# Altium schematic sheet hdmi.SchDoc
size A
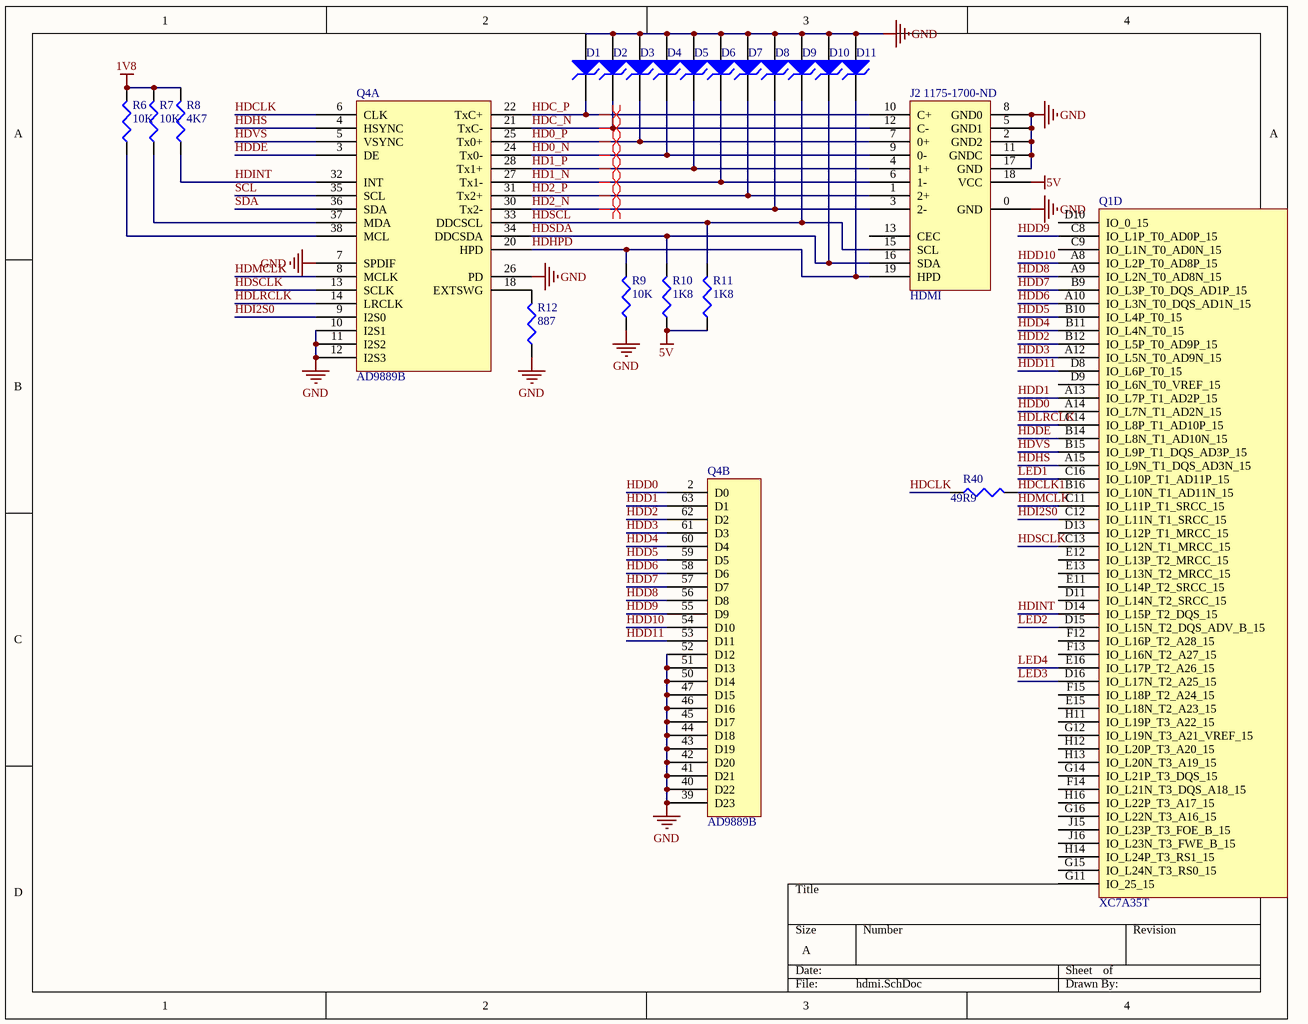
[diagram p0: hdmi.SchDoc]

## Parts
D1  EZAEG2A  [CAPC1005X55N]  (value not drawn)
D2  EZAEG2A  [CAPC1005X55N]  (value not drawn)
D3  EZAEG2A  [CAPC1005X55N]  (value not drawn)
D4  EZAEG2A  [CAPC1005X55N]  (value not drawn)
D5  EZAEG2A  [CAPC1005X55N]  (value not drawn)
D6  EZAEG2A  [CAPC1005X55N]  (value not drawn)
D7  EZAEG2A  [CAPC1005X55N]  (value not drawn)
D8  EZAEG2A  [CAPC1005X55N]  (value not drawn)
D9  EZAEG2A  [CAPC1005X55N]  (value not drawn)
D10  EZAEG2A  [CAPC1005X55N]  (value not drawn)
D11  EZAEG2A  [CAPC1005X55N]  (value not drawn)
J2  HDMI  Supplier Part Number 1: 1175-1700-ND  [2000-1-1-20-00-BK]
Q1  XC7A35T  (part D of 6)
Q4  AD9889B  [QFN50P900X875X100_HS-65N]  (parts A,B of 3)
R6  value 10K  [CAPC1608X90N]  (hidden comment: Res3)
R7  value 10K  [CAPC1608X90N]  (hidden comment: Res3)
R8  value 4K7  [CAPC1608X90N]  (hidden comment: Res3)
R9  value 10K  [CAPC1608X90N]  (hidden comment: Res3)
R10  value 1K8  [CAPC1608X90N]  (hidden comment: Res3)
R11  value 1K8  [CAPC1608X90N]  (hidden comment: Res3)
R12  value 887  [CAPC1608X90N]  (hidden comment: Res3)
R40  value 49R9  [CAPC1005X06L]  (hidden comment: Res3)

## Nets
1V8: R6.2 R7.2 R8.2
5V: J2.18(VCC) R10.1 R11.1
GND: D1.1(A) D2.1(A) D3.1(A) D4.1(A) D5.1(A) D6.1(A) D7.1(A) D8.1(A) D9.1(A) D10.1(A) D11.1(A) J2.0(GND) J2.2(GND2) J2.5(GND1) J2.8(GND0) J2.11(GNDC) J2.17(GND) Q4.7(SPDIF) Q4.10(I2S1) Q4.11(I2S2) Q4.12(I2S3) Q4.26(PD) Q4.39(D23) Q4.40(D22) Q4.41(D21) Q4.42(D20) Q4.43(D19) Q4.44(D18) Q4.45(D17) Q4.46(D16) Q4.47(D15) Q4.50(D14) Q4.51(D13) Q4.52(D12) R9.1 R12.1
HD0_N: D4.2(K) J2.9(0-) Q4.24(Tx0-)
HD0_P: D3.2(K) J2.7(0+) Q4.25(Tx0+)
HD1_N: D6.2(K) J2.6(1-) Q4.27(Tx1-)
HD1_P: D5.2(K) J2.4(1+) Q4.28(Tx1+)
HD2_N: D8.2(K) J2.3(2-) Q4.30(Tx2-)
HD2_P: D7.2(K) J2.1(2+) Q4.31(Tx2+)
HDC_N: D2.2(K) J2.12(C-) Q4.21(TxC-)
HDC_P: D1.2(K) J2.10(C+) Q4.22(TxC+)
HDCLK: Q4.6(CLK) R40.1
HDCLK1: Q1.B16(IO_L10N_T1_AD11N_15) R40.2
HDD0: Q1.A14(IO_L7N_T1_AD2N_15) Q4.2(D0)
HDD1: Q1.A13(IO_L7P_T1_AD2P_15) Q4.63(D1)
HDD2: Q1.B12(IO_L5P_T0_AD9P_15) Q4.62(D2)
HDD3: Q1.A12(IO_L5N_T0_AD9N_15) Q4.61(D3)
HDD4: Q1.B11(IO_L4N_T0_15) Q4.60(D4)
HDD5: Q1.B10(IO_L4P_T0_15) Q4.59(D5)
HDD6: Q1.A10(IO_L3N_T0_DQS_AD1N_15) Q4.58(D6)
HDD7: Q1.B9(IO_L3P_T0_DQS_AD1P_15) Q4.57(D7)
HDD8: Q1.A9(IO_L2N_T0_AD8N_15) Q4.56(D8)
HDD9: Q1.C8(IO_L1P_T0_AD0P_15) Q4.55(D9)
HDD10: Q1.A8(IO_L2P_T0_AD8P_15) Q4.54(D10)
HDD11: Q1.D8(IO_L6P_T0_15) Q4.53(D11)
HDDE: Q1.B14(IO_L8N_T1_AD10N_15) Q4.3(DE)
HDHPD: D11.2(K) J2.19(HPD) Q4.20(HPD) R9.2
HDHS: Q1.A15(IO_L9N_T1_DQS_AD3N_15) Q4.4(HSYNC)
HDI2S0: Q1.C12(IO_L11N_T1_SRCC_15) Q4.9(I2S0)
HDINT: Q1.D14(IO_L15P_T2_DQS_15) Q4.32(INT) R8.1
HDLRCLK: Q1.C14(IO_L8P_T1_AD10P_15) Q4.14(LRCLK)
HDMCLK: Q1.C11(IO_L11P_T1_SRCC_15) Q4.8(MCLK)
HDSCL: D9.2(K) J2.15(SCL) Q4.33(DDCSCL) R11.2
HDSCLK: Q1.C13(IO_L12N_T1_MRCC_15) Q4.13(SCLK)
HDSDA: D10.2(K) J2.16(SDA) Q4.34(DDCSDA) R10.2
HDVS: Q1.B15(IO_L9P_T1_DQS_AD3P_15) Q4.5(VSYNC)
LED1: Q1.C16(IO_L10P_T1_AD11P_15)
LED2: Q1.D15(IO_L15N_T2_DQS_ADV_B_15)
LED3: Q1.D16(IO_L17N_T2_A25_15)
LED4: Q1.E16(IO_L17P_T2_A26_15)
SCL: Q4.35(SCL)
SDA: Q4.36(SDA)
NetQ4_18: Q4.18(EXTSWG) R12.2
NetQ4_37: Q4.37(MDA) R7.1
NetQ4_38: Q4.38(MCL) R6.1

Not connected (* = marked no-connect by the designer): J2 13(CEC); Q1 C9(IO_L1N_T0_AD0N_15) D9(IO_L6N_T0_VREF_15) D10(IO_0_15) D11(IO_L14N_T2_SRCC_15) D13(IO_L12P_T1_MRCC_15) E11(IO_L14P_T2_SRCC_15) E12(IO_L13P_T2_MRCC_15) E13(IO_L13N_T2_MRCC_15) E15(IO_L18N_T2_A23_15) F12(IO_L16P_T2_A28_15) F13(IO_L16N_T2_A27_15) F14(IO_L21N_T3_DQS_A18_15) F15(IO_L18P_T2_A24_15) G11(IO_25_15) G12(IO_L19N_T3_A21_VREF_15) G14(IO_L21P_T3_DQS_15) G15(IO_L24N_T3_RS0_15) G16(IO_L22N_T3_A16_15) H11(IO_L19P_T3_A22_15) H12(IO_L20P_T3_A20_15) H13(IO_L20N_T3_A19_15) H14(IO_L24P_T3_RS1_15) H16(IO_L22P_T3_A17_15) J15(IO_L23P_T3_FOE_B_15) J16(IO_L23N_T3_FWE_B_15)

## Layout directives
differential pair: HD0_N, HD0_P, HD1_N, HD1_P, HD2_N, HD2_P, HDC_N, HDC_P

## Library data of the parts
D1-D11 = D Zener: Zener Diode; Published: 8-Jun-2000; LatestRevisionDate: 17-Jul-2002; LatestRevisionNote: Re-released for DXP Platform.; PackageReference: DIODE-0.7; Publisher: Altium Limited; PackageDescription: Diode, Thru-Hole; 2 Leads; 0.7 in Pin Spacing; Supplier 1: Digi-Key; Supplier Part Number 1: P13571CT-ND
R6-R12 R40 = Res3: Resistor; Published: 8-Jun-2000; LatestRevisionDate: 29-May-2009; LatestRevisionNote: IPC-7351 Footprint Added.; PackageReference: J1-0603; Publisher: Altium Limited; PackageDescription: Chip Resistor; Supplier 1: Digi-Key
  R6 R7 R9: Supplier Part Number 1: 1276-3485-1-ND
  R8: Supplier Part Number 1: 1276-5078-1-ND
  R10 R11: Supplier Part Number 1: 1276-5068-1-ND
  R12: Supplier Part Number 1: 1276-4640-1-ND
  R40: Supplier Part Number 1: 1276-3505-1-ND
J2 = HDMI: Supplier 1: Digi-Key